# EAGLE design SparkFun_tDof-TMF8821_Mini (EAGLE 9.6.2)
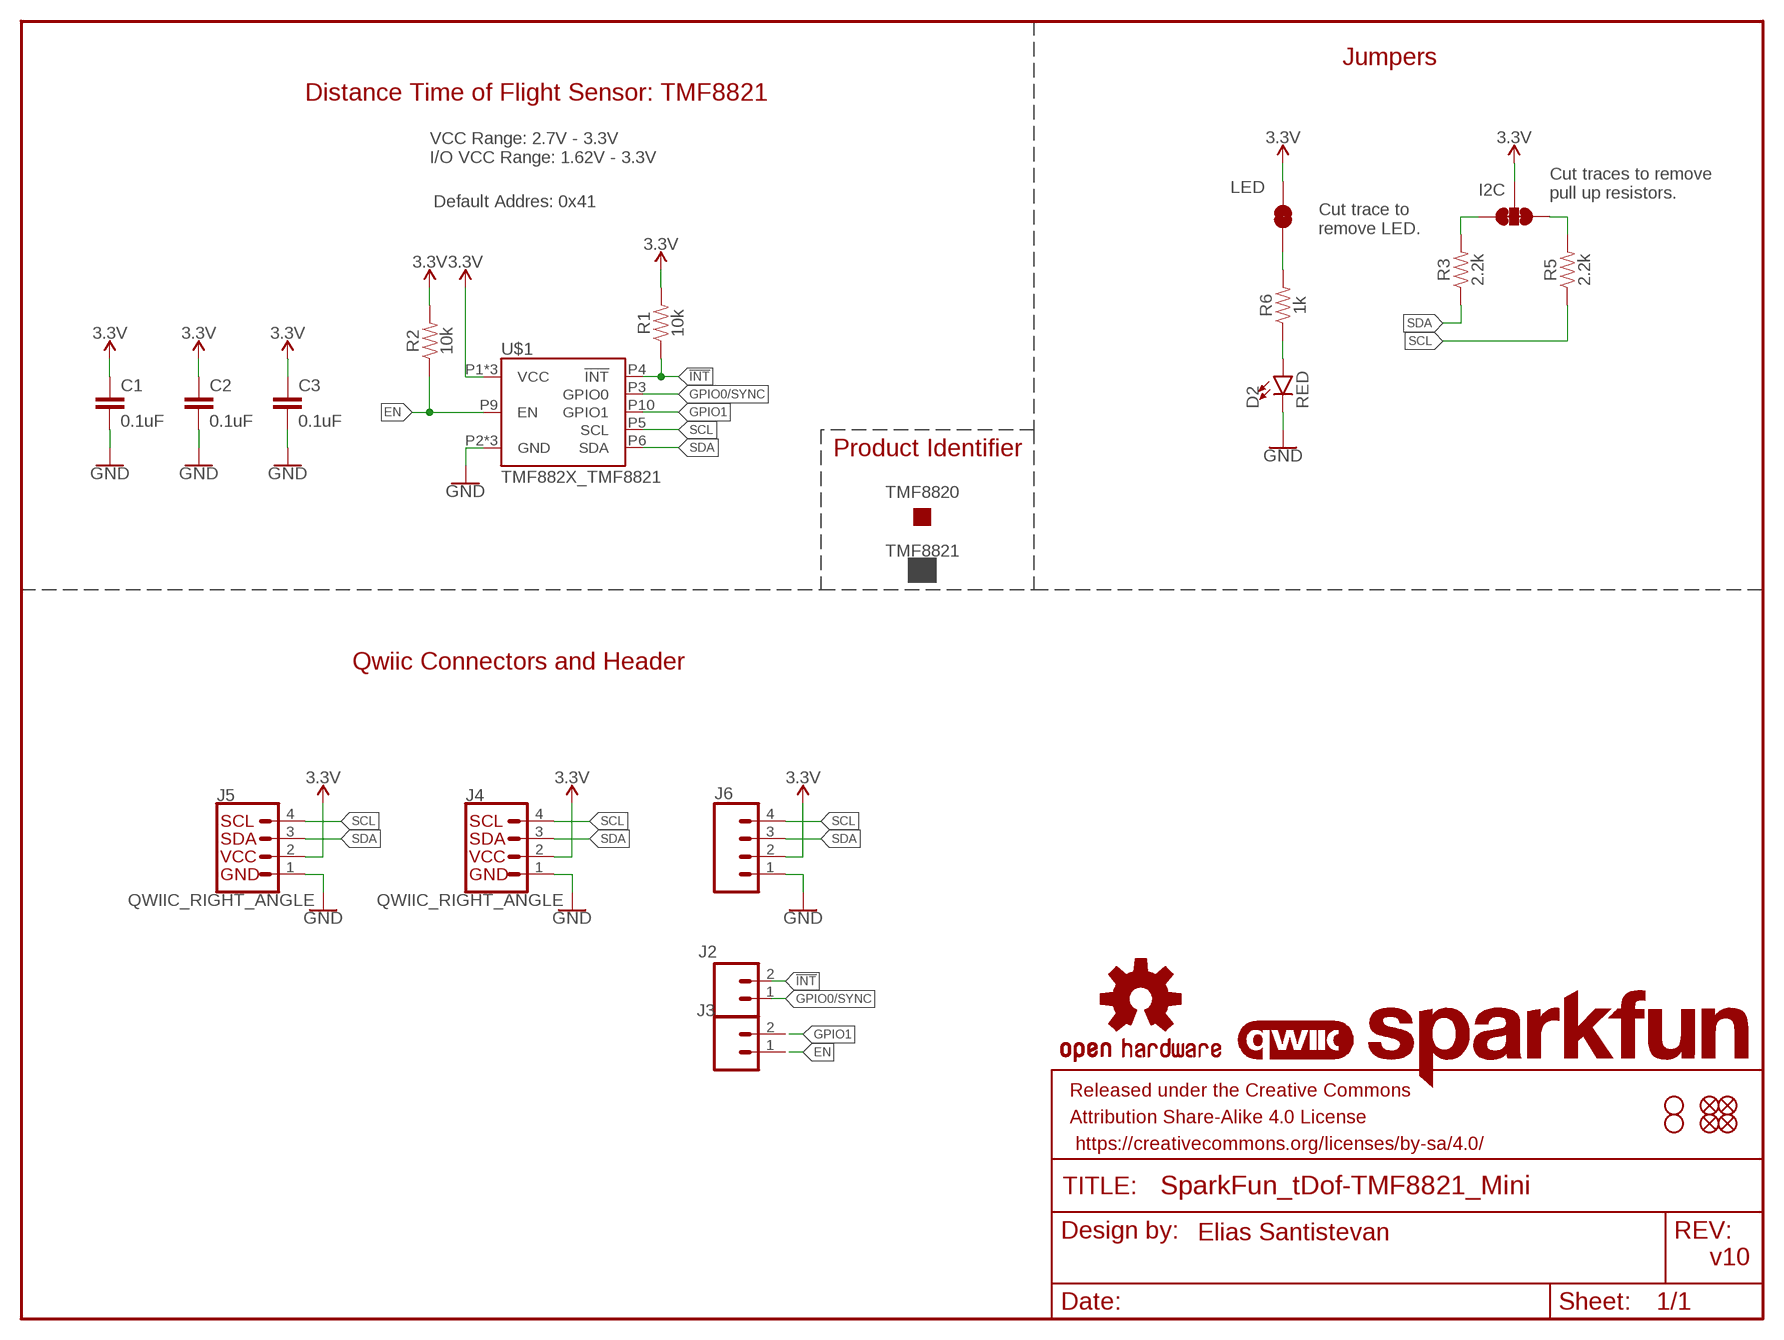
[diagram p0: schematic, sheet 1]

## Parts
C1  0.1uF  0.1UF-0402T-6.3V-10%-X7R  [0402-TIGHT]
C2  0.1uF  0.1UF-0402T-6.3V-10%-X7R  [0402-TIGHT]
C3  0.1uF  0.1UF-0402T-6.3V-10%-X7R  [0402-TIGHT]
D2  RED  LED-RED0603  [LED-0603]
FD5  FIDUCIALUFIDUCIAL  [FIDUCIAL-MICRO]
FD6  FIDUCIALUFIDUCIAL  [FIDUCIAL-MICRO]
FD7  FIDUCIALUFIDUCIAL  [FIDUCIAL-MICRO]
FD8  FIDUCIALUFIDUCIAL  [FIDUCIAL-MICRO]
FRAME2  FRAME-LETTER  [CREATIVE_COMMONS]
H7  STAND-OFFTIGHT  [STAND-OFF-TIGHT]
H8  STAND-OFFTIGHT  [STAND-OFF-TIGHT]
I2C  I2C_PU  JUMPER-SMT_3_2-NC_TRACE_SILK  [SMT-JUMPER_3_2-NC_TRACE_SILK]
J2  CONN_021X02_NO_SILK  [1X02_NO_SILK]
J3  CONN_021X02_NO_SILK  [1X02_NO_SILK]
J4  QWIIC_RIGHT_ANGLE  QWIIC_CONNECTORJS-1MM  [JST04_1MM_RA]
J5  QWIIC_RIGHT_ANGLE  QWIIC_CONNECTORJS-1MM  [JST04_1MM_RA]
J6  CONN_041X04_NO_SILK  [1X04_NO_SILK]
LED  LED  JUMPER-SMT_2_NC_TRACE_SILK  [SMT-JUMPER_2_NC_TRACE_SILK]
LOGO1  SFE_LOGO_NAMEBLANK  [BLANK]
LOGO2  QWIIC_LOGO_4MM  [QWIIC_4MM]
LOGO3  OSHW-LOGONO_SILK  [DUMMY]
R1  10k  10KOHM-0402T-1/16W-1%  [0402-TIGHT]
R2  10k  10KOHM-0402T-1/16W-1%  [0402-TIGHT]
R3  2.2k  2.2KOHM-0402T-1/16W-1%  [0402-TIGHT]
R5  2.2k  2.2KOHM-0402T-1/16W-1%  [0402-TIGHT]
R6  1k  1KOHM-0402T-1/16W-1%  [0402-TIGHT]
TMF8820  PROD_ID_NO-PASTE_SILK  [PRODUCT_IDENT_NO_SILK]
TMF8821  PROD_ID_PASTE_SILK  [PRODUCT_IDENT_PASTE_SILK]
U$1  TMF882X_TMF8821  [TMF882X]

## Nets
3.3V: C1.1 C2.1 C3.1 I2C.2 J4.2 J5.2 J6.2 LED.2 R1.2 R2.2 U$1.P1(VCC) U$1.P7(VCC) U$1.P12(VCC)
!INT!: J2.2 R1.1 U$1.P4(!INT!)
EN: J3.1 R2.1 U$1.P9(EN)
GND: C1.2 C2.2 C3.2 D2.C J4.1 J5.1 J6.1 U$1.P2(GND) U$1.P8(GND) U$1.P11(GND)
GPIO0/SYNC: J2.1 U$1.P3(GPIO0)
GPIO1: J3.2 U$1.P10(GPIO1)
N$5: D2.A R6.1
N$6: LED.1 R6.2
N$7: I2C.3 R3.2
N$8: I2C.1 R5.2
SCL: J4.4 J5.4 J6.4 R5.1 U$1.P5(SCL)
SDA: J4.3 J5.3 J6.3 R3.1 U$1.P6(SDA)

## Notes on the sheet
- Jumpers
- Distance Time of Flight Sensor: TMF8821
- VCC Range: 2.7V - 3.3V
  I/O VCC Range: 1.62V - 3.3V
- Cut traces to remove 
  pull up resistors.
- Default Addres: 0x41
- Cut trace to 
  remove LED.
- Product Identifier
- Qwiic Connectors and Header
- Elias Santistevan
- v10

## Library data of the parts
C1-C3 = SparkFun-Capacitors:0.1UF: 0.1µF ceramic capacitors A capacitor is a passive two-terminal electrical component used to store electrical energy temporarily in an electric field.; PROD_ID: CAP-14993
D2 = SparkFun-LED:LED-RED: Red SMD LED Used in manufacturing of most products at SparkFun Packages: 0603 - SMD 0603 package [Product Link] <http://docs.avagotech.com/docs/AV02-0551EN> 0603 SMART - SMD 0603 SMART package ( more efficient and expensive)[Product Link] <http://www.osram-os.com/Graphics/XPic2/00077099_0.pdf> 1206 - SMD1206 package [Product Link] <https://www.sparkfun.com/datasheets/DevTools/LilyPad/Q150OVS4.pdff> SparkFun Products: Pro Mini 328 -5V <https://www.sparkfun.com/products/821> RedBoard <https://www.sparkfun.com/products/12757> IOIO-OTG <https://www.sparkfun.com/products/13613>; PROD_ID: DIO-00819
FD5-FD8 = SparkFun-Aesthetics:FIDUCIAL: Fiducial Alignment Points Point-of-reference for pick-and-place machines and other optical instruments.
FRAME2 = SparkFun-Aesthetics:FRAME-LETTER: Schematic Frame - Letter Standard 8.5x11 US Letter frame
H7 H8 = SparkFun-Hardware:STAND-OFF: Stand Off Drill holes for mechanically mounting via screws, standoffs, etc. Note: Use the keepout ring to avoid running the screw head into surrounding components. Variant Overviews STAND-OFF - Mechanical footprint for a #4 phillips button head screw. STAND-OFF-TIGHT - Mechanical footprint for a #4 phillips button head screw, Example SparkFun Products Screw - Phillips Head (1/4", 4-40, 10 pack) <https://www.sparkfun.com/products/10453> (PRT-10453) Screw - Phillips Head (1/2", 4-40, 10 pack) <https://www.sparkfun.com/products/10452> (PRT-10452) Screw - Phillips Head (3/4", 4-40, 10 pack) <https://www.sparkfun.com/products/10451> (PRT-10451) Screw - Phillips Head (1", 4-40, 10 pack) <https://www.sparkfun.com/products/10450> (PRT-10450)
I2C = SparkFun-Jumpers:JUMPER-SMT_3_2-NC_TRACE: Normally closed trace jumper (2 of 2 connections) This jumper has a trace between all three pads so they are normally closed (NC). Use a razor knife to open the connection(s). For best results follow the IPC guidelines for cutting traces: Cutout at least 0.063 mm (0.005 in). Remove all loose material to clean up the cut area. Seal the cut with an approved epoxy. Reapply solder to reclose the connection(s).
J2 J3 = SparkFun-Connectors:CONN_02: Multi connection point. Often used as Generic Header-pin footprint for 0.1 inch spaced/style header connections On any of the 0.1 inch spaced packages, you can populate with these: Break Away Headers - Straight <https://www.sparkfun.com/products/116> (PRT-00116) Break Away Male Headers - Right Angle <https://www.sparkfun.com/products/553> (PRT-00553) Female Headers <https://www.sparkfun.com/products/115> (PRT-00115) Break Away Headers - Machine Pin <https://www.sparkfun.com/products/117> (PRT-00117) Break Away Female Headers - Swiss Machine Pin <https://www.sparkfun.com/products/743> (PRT-00743) For SCREWTERMINALS and SPRING TERMINALS visit here: Screw Terimnals on SparkFun.com <https://www.sparkfun.com/search/results?term=Screw+Terminals> (5mm/3.5mm/2.54mm spacing) This device is also useful as a general connection point to wire up your design to another part of your project. Our various solder wires solder well into these plated through hole pads. Hook-Up Wire - Assortment (Stranded, 22 AWG) <https://www.sparkfun.com/products/11375> (PRT-11375) Hook-Up Wire - Assortment (Solid Core, 22 AWG) <https://www.sparkfun.com/products/11367> (PRT-11367) View the entire wire category on our website here <https://www.sparkfun.com/categories/141> Special notes: Molex polarized connector foot print use with: PRT-08233 with associated crimp pins and housings. 2.54_SCREWTERM for use with PRT-10571. 3.5mm Screw Terminal footprints for PRT-08084 5mm Screw Terminal footprints for use with PRT-08432
J4 J5 = SparkFun-Connectors:QWIIC_CONNECTOR: SparkFun I2C Standard Qwiic Connector An SMD 1mm pitch JST connector makes it easy and quick (get it? Qwiic?) to connect I2C devices to each other. The Qwiic system <http://www.sparkfun.com/qwiic> enables fast and solderless connection between popular platforms and various sensors and actuators. We carry 200mm <https://www.sparkfun.com/products/14204>, 100mm <https://www.sparkfun.com/products/14205>, 50mm <https://www.sparkfun.com/products/14206>, and breadboard friendly <https://www.sparkfun.com/products/14207> Qwiic cables. We also offer 10 pcs strips <https://www.sparkfun.com/products/14323> the SMD connectors.; PROD_ID: CONN-13694
J6 = SparkFun-Connectors:CONN_04: Multi connection point. Often used as Generic Header-pin footprint for 0.1 inch spaced/style header connections On any of the 0.1 inch spaced packages, you can populate with these: Break Away Headers - Straight <https://www.sparkfun.com/products/116> (PRT-00116) Break Away Male Headers - Right Angle <https://www.sparkfun.com/products/553> (PRT-00553) Female Headers <https://www.sparkfun.com/products/115> (PRT-00115) Break Away Headers - Machine Pin <https://www.sparkfun.com/products/117> (PRT-00117) Break Away Female Headers - Swiss Machine Pin <https://www.sparkfun.com/products/743> (PRT-00743) For SCREWTERMINALS and SPRING TERMINALS visit here: Screw Terimnals on SparkFun.com <https://www.sparkfun.com/search/results?term=Screw+Terminals> (5mm/3.5mm/2.54mm spacing) This device is also useful as a general connection point to wire up your design to another part of your project. Our various solder wires solder well into these plated through hole pads. Hook-Up Wire - Assortment (Stranded, 22 AWG) <https://www.sparkfun.com/products/11375> (PRT-11375) Hook-Up Wire - Assortment (Solid Core, 22 AWG) <https://www.sparkfun.com/products/11367> (PRT-11367) View the entire wire category on our website here <https://www.sparkfun.com/categories/141> Special notes: Molex polarized connector foot print use with SKU : PRT-08231 with associated crimp pins and housings. 1MM SMD Version SKU: PRT-10208; PROD_ID: CONN-09696
LED = SparkFun-Jumpers:JUMPER-SMT_2_NC_TRACE: Normally closed trace jumper This jumper has a trace between two pads so it's normally closed (NC). Use a razor knife to open the connection. For best results follow the IPC guidelines for cutting traces: Cutout at least 0.063 mm (0.005 in). Remove all loose material to clean up the cut area. Seal the cut with an approved epoxy. Reapply solder to reclose the connection.
LOGO1 = SparkFun-Aesthetics:SFE_LOGO_NAME: SparkFun Font Logo This is the SparkFun name logo. The logo on the schematic will always be the same size; the package variant is the height of the flame part of the logo (or the height the flame would be, if it were drawn). Default layer for the logo on the board is tSilk.
LOGO2 = SparkFun-Aesthetics:QWIIC_LOGO: Qwiic Logos for placement on schematic and PCB. The 5.5mm silk logo is best for placing next to Qwiic connector.
LOGO3 = SparkFun-Aesthetics:OSHW-LOGO: Open-Source Hardware (OSHW) Logo This logo indicates the piece of hardware it is found on incorporates a OSHW license and/or adheres to the definition of open source hardware found here: http://freedomdefined.org/OSHW
R1 R2 = SparkFun-Resistors:10KOHM: 10kΩ resistor A resistor is a passive two-terminal electrical component that implements electrical resistance as a circuit element. Resistors act to reduce current flow, and, at the same time, act to lower voltage levels within circuits. - Wikipedia; PROD_ID: RES-14241
R3 R5 = SparkFun-Resistors:2.2KOHM: 2.2kΩ resistor A resistor is a passive two-terminal electrical component that implements electrical resistance as a circuit element. Resistors act to reduce current flow, and, at the same time, act to lower voltage levels within circuits. - Wikipedia; PROD_ID: RES-14341
R6 = SparkFun-Resistors:1KOHM: 1kΩ resistor A resistor is a passive two-terminal electrical component that implements electrical resistance as a circuit element. Resistors act to reduce current flow, and, at the same time, act to lower voltage levels within circuits. - Wikipedia; PROD_ID: RES-14342
TMF8820 = SparkFun-Aesthetics:PROD_ID_NO-PASTE
TMF8821 = SparkFun-Aesthetics:PROD_ID_PASTE
U$1 = TMF882X:TMF882X; PROD_ID: IC-16433

## Board
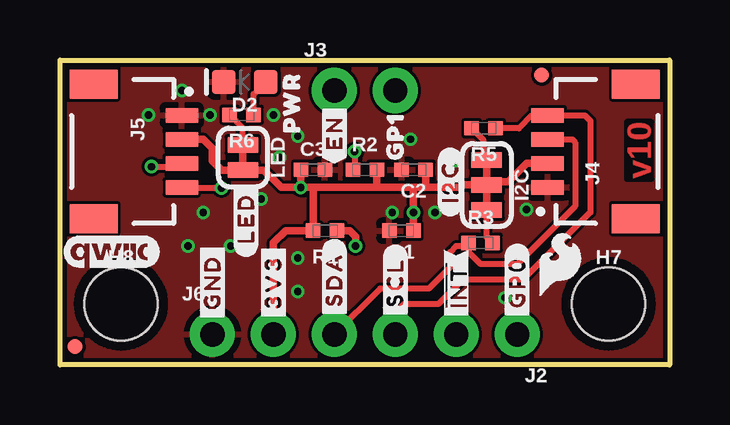
[diagram p1: board, top side]
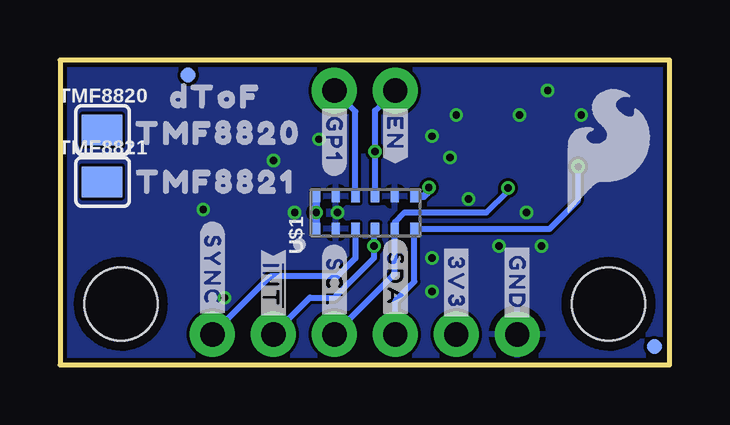
[diagram p2: board, bottom side, seen from below]

Size 25.4 x 12.7 mm. Coordinates in mm from the lower left corner, seen from the top.
Outline: 0,0 0,12.7 25.4,12.7 25.4,0 0,0
Copper layers (1*16): Top 0.035mm / dielectric 1.5mm / Bottom 0.035mm
Design rules "SparkFun-2-Layer-Minimum-JLCPCB": minimum track width 5mil, minimum drill 0.3mm, track to track 5mil, track to pad 5mil, pad to pad 5mil, via to via 5mil, smd to smd 5mil, copper to edge 7mil, drill to drill 7mil, minimum pad ring 5mil, minimum via ring 5mil, stop-mask expansion 2.5mil, vias tented up to drill 25mil, thermal gap 10mil

### Footprints (pad centres in the part's own frame; a part is rotated, then mirrored left to right if it is on the bottom)
0402-TIGHT = smd 0.6 x 0.6: 1 -0.5,0; 2 0.5,0
LED-0603 = smd 1 x 1: A -0.877,0; C 0.877,0
FIDUCIAL-MICRO = smd 0.635 x 0.635: 1 0,0
STAND-OFF-TIGHT = hole 3.048: 0,0
SMT-JUMPER_3_2-NC_TRACE_SILK = smd 0.66 x 1.27: 1 -1.041,0; 2 0,0; 3 1.041,0
1X02_NO_SILK = drill 1.016 pad 1.88: 1 0,0; 2 2.54,0
JST04_1MM_RA = smd 0.6 x 1.35: 1 -1.5,0; 2 -0.5,0; 3 0.5,0; 4 1.5,0 | smd 1.2 x 2: NC1 2.8,-3.675; NC2 -2.8,-3.675
1X04_NO_SILK = drill 1.016 pad 1.88: 1 0,0; 2 2.54,0; 3 5.08,0; 4 7.62,0
SMT-JUMPER_2_NC_TRACE_SILK = smd 0.66 x 1.27: 1 -0.521,0; 2 0.521,0
PRODUCT_IDENT_NO_SILK = smd 1.676 x 1.27: 1 -0.025,0
PRODUCT_IDENT_PASTE_SILK = smd 1.676 x 1.27: 1 -0.025,0
TMF882X = smd 0.5 x 0.35: P1 -0.686,2.032; P2 -0.686,1.212; P3 -0.686,0.392; P4 -0.686,-0.428; P5 -0.686,-1.248; P6 -0.686,-2.068; P7 0.664,-2.068; P8 0.664,-1.248; P9 0.664,-0.428; P10 0.664,0.392; P11 0.664,1.212; P12 0.664,2.032

### Placement (x,y rotation side)
C1  14.22,5.59 180 top
C2  14.73,8.13 180 top
C3  10.54,8.13 0 top
D2  7.7,11.79 180 top
FD5  20.07,12.06 0 bottom
FD6  0.64,0.76 0 bottom
FD7  0.64,0.76 0 top
FD8  20.07,12.06 0 top
FRAME2  -11.94,-12.95 0 top  (outside the outline)
H7  22.86,2.54 0 top
H8  2.54,2.54 0 top
I2C  17.78,7.49 270 top
J2  19.05,1.27 180 top
J3  11.43,11.43 0 top
J4  20.32,8.89 90 top
J5  5.08,8.89 270 top
J6  6.35,1.27 0 top
LED  7.62,8.64 270 top
LOGO1  -11.94,-12.95 0 top  (outside the outline)
LOGO2  2.16,4.7 0 top
LOGO3  -11.94,-12.95 0 top  (outside the outline)
R1  11.05,5.59 180 top
R2  12.7,8.13 0 top
R3  17.53,5.08 0 top
R5  17.65,9.86 180 top
R6  7.57,10.41 180 top
TMF8820  23.62,9.78 0 bottom
TMF8821  23.62,7.62 0 bottom
U$1  12.7,6.35 90 bottom
U$2  [#LED#10]  7.75,6.1 90 top
U$3  [##INT##9]  16.51,3.3 90 top
U$4  [##INT##8]  16.51,3.3 270 bottom
U$5  [#SYNC#8]  19.05,3.94 270 bottom
U$6  [#GP1#8]  13.97,9.4 270 bottom
U$7  [DTOF882188211]  18.92,11.18 0 bottom
U$8  [TMF882020]  18.8,9.65 0 bottom
U$9  [#EN#7]  11.43,9.65 90 top
U$10  [#3V3#0]  8.89,3.43 270 bottom
U$11  [TMF882188210]  18.92,7.62 0 bottom
U$12  [GP18]  13.97,9.53 90 top
U$13  [#GP0#19]  19.05,3.43 90 top
U$14  [SFE_LOGO_FLAME_.2]  2.54,8.89 0 bottom
U$16  [#GND#4]  6.35,3.43 270 bottom
U$18  [#SDA#6]  11.43,3.56 270 bottom
U$19  [#SCL#5]  13.97,3.43 270 bottom
U$20  [#I2C#11]  16.26,7.62 90 top
U$31  [#EN#7]  11.43,9.65 270 bottom
U$35  [SFE_LOGO_FLAME_.1]  20.83,4.19 0 top
U$37  [#3V3#0]  8.89,3.43 90 top
U$38  [#GND#4]  6.35,3.43 90 top
U$39  [#SCL#5]  13.97,3.43 90 top
U$40  [#SDA#6]  11.43,3.56 90 top
U$43  [PWR8821882023]  9.65,10.92 90 top

### Tracks (layer width: path | path; a pad name or v marks a point on that pad's centre or on a via)
3.3V  (via drill 0.3)
  Top 0.305: J5.2 5.98,9.39 6.35,9.02 6.35,8.51 6.74,8.12 LED.2 8.49,8.12 9.22,7.39 v10.03,7.39 | J4.2 19.44,8.39 18.67,7.62 17.91,7.62 I2C.2 16.76,7.49 16.66,7.39 15.24,7.39 | C1.1 v14.72,6.35 14.72,7.38 14.73,7.39 | J6.2 8.89,5.08 9.4,5.59 R1.2 10.55,7.38 10.54,7.39 | R2.2 13.21,7.39 | v10.03,7.39 10.54,7.39 | 10.54,7.39 13.21,7.39 | 15.24,7.39 14.73,7.39 | 14.73,7.39 13.21,7.39 | C3.1 10.04,7.4 v10.03,7.39 | C2.1 15.24,7.39
  Bottom 0.305: U$1.P12 14.73,6.36 v14.72,6.35 14.73,6.34 U$1.P1 | U$1.P7 10.25,7.01 10.03,7.23 v10.03,7.39
!INT!  (via drill 0.3)
  Top 0.305: R1.1 12.06,5.59 12.32,5.33 v12.32,4.95
  Bottom 0.254: U$1.P4 12.32,5.62 v12.32,4.95 12.32,4.45 13.97,2.79 14.99,2.79 J2.2
EN  (via drill 0.3)
  Top 0.254: R2.1 12.28,8.2 v12.28,8.89 v12.27,8.89
  Bottom 0.254: U$1.P9 v12.27,8.89 12.27,10.59 J3.1
GND  (via drill 0.3)
  other vias: 9.91,9.53 14.61,9.4 19.43,6.48 13.84,6.35 9.91,4.45 9.91,3.05 18.54,2.79 5.08,11.43 3.68,10.41 15.62,6.35 16.51,8.51 5.97,6.35 5.33,4.95 7.11,4.95 8.38,6.91 9.14,8.64 6.25,10.41 8.89,10.41
  pour Top: 0,12.7 25.4,12.7 25.4,0 0,0
  pour Bottom: 0,12.7 25.4,12.7 25.4,0 0,0
GPIO0/SYNC
  Bottom 0.254: U$1.P3 13.09,4.43 13.84,3.68 16.64,3.68 J2.1
GPIO1
  Bottom 0.254: U$1.P10 13.09,10.55 J3.2
N$5
  Top 0.254: R6.1 8.07,11.28 D2.A
N$6
  Top 0.254: LED.1 7.62,9.86 R6.2
N$7
  Top 0.254: R3.2 17.78,5.33 I2C.3
N$8
  Top 0.254: I2C.1 17.65,8.66 17.65,9.36 R5.2
SCL  (via drill 0.3)
  Top 0.254: R5.1 19.13,9.86 19.66,10.39 J4.4 21.87,10.39 22.1,10.16 22.1,6.35 19.3,3.56 16.8,3.56 15.78,2.54 14.35,2.54 13.97,2.16 J6.4 | v6.73,7.37 5.1,7.37 J5.4
  Bottom 0.254: J6.4 11.45,3.79 U$1.P5 11.45,5.95 11.05,6.35 7.62,6.35 6.73,7.24 v6.73,7.37
SDA  (via drill 0.3)
  Top 0.254: J4.3 21.34,9.39 21.46,9.27 21.46,6.6 19.05,4.19 17.53,4.19 17.03,4.69 17.03,4.95 | 17.03,4.95 R3.1 | J6.3 13.34,3.17 15.37,3.17 16.26,4.06 16.26,4.7 16.51,4.95 17.03,4.95 | v3.81,8.26 4.95,8.26 J5.3
  Bottom 0.254: J6.3 11.43,2.67 10.63,3.46 U$1.P6 5,5.66 3.81,6.86 v3.81,8.26

### Text on the board
Top: v10
Measures: Units in Inches
tDocu: Elias Santistevan